# Altium schematic sheet 5V-3v3电平转换参考电路.SchDoc
size A4
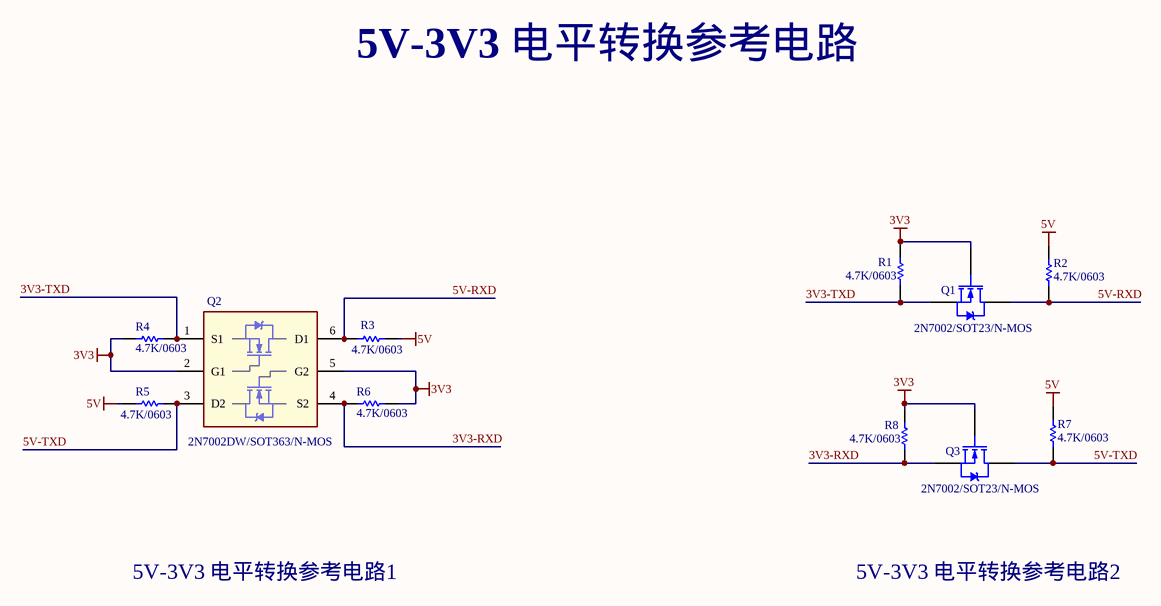
[diagram p0: 5V-3v3电平转换参考电路.SchDoc]

## Parts
Q1  2N7002/SOT23/N-MOS  [SOT_23]
Q2  2N7002DW/SOT363/N-MOS  [SOT363]
Q3  2N7002/SOT23/N-MOS  [SOT_23]
R1  4.7K/0603  [R_0603]
R2  4.7K/0603  [R_0603]
R3  4.7K/0603  [R_0402]
R4  4.7K/0603  [R_0402]
R5  4.7K/0603  [R_0402]
R6  4.7K/0603  [R_0402]
R7  4.7K/0603  [R_0603]
R8  4.7K/0603  [R_0603]

## Nets
3V3: Q1.1(G) Q2.2(G1) Q2.5(G2) Q3.1(G) R1.1 R4.1 R6.2 R8.1
5V: R2.1 R3.2 R5.1 R7.1
3V3-RXD: Q2.4(S2) Q3.2(S) R6.1 R8.2
3V3-TXD: Q1.2(S) Q2.1(S1) R1.2 R4.2
5V-RXD: Q1.3(D) Q2.6(D1) R2.2 R3.1
5V-TXD: Q2.3(D2) Q3.3(D) R5.2 R7.2

## Notes on the sheet
- 5V-3V3 电平转换参考电路
- 5V-3V3 电平转换参考电路1
- 5V-3V3 电平转换参考电路2

## Library data of the parts
Q1 Q3 = NMOS-2: N-Channel Power MOSFET; Note: Pin 2 is electrically connected to pin 4.; Published: 8-Jun-2000; LatestRevisionDate: 17-Jul-2002; LatestRevisionNote: Re-released for DXP Platform.; DatasheetDocument: PD-9.814; PackageReference: TO-220AB; Publisher: Altium Limited; Code_JEDEC: TO-220-AB; ComponentLink1Description: Manufacturer Link; ComponentLink1URL: http://www.irf.com/
Q2 = 2N7002DW: N-Channel Power MOSFET; Note: Pin 2 is electrically connected to pin 4.; Published: 8-Jun-2000; LatestRevisionDate: 17-Jul-2002; LatestRevisionNote: Re-released for DXP Platform.; DatasheetDocument: PD-9.814; PackageReference: TO-220AB; Publisher: Altium Limited; Code_JEDEC: TO-220-AB; ComponentLink1Description: Manufacturer Link; ComponentLink1URL: http://www.irf.com/
R1-R8 = Res1: Resistor; Value: 1K; Published: 8-Jun-2000; LatestRevisionDate: 17-Jul-2002; LatestRevisionNote: Re-released for DXP Platform.; PackageReference: AXIAL-0.3; Publisher: Altium Limited